# EAGLE design WaterFlowSensor-RJ11-Adaptor-V2.0 (EAGLE 7.4.0)
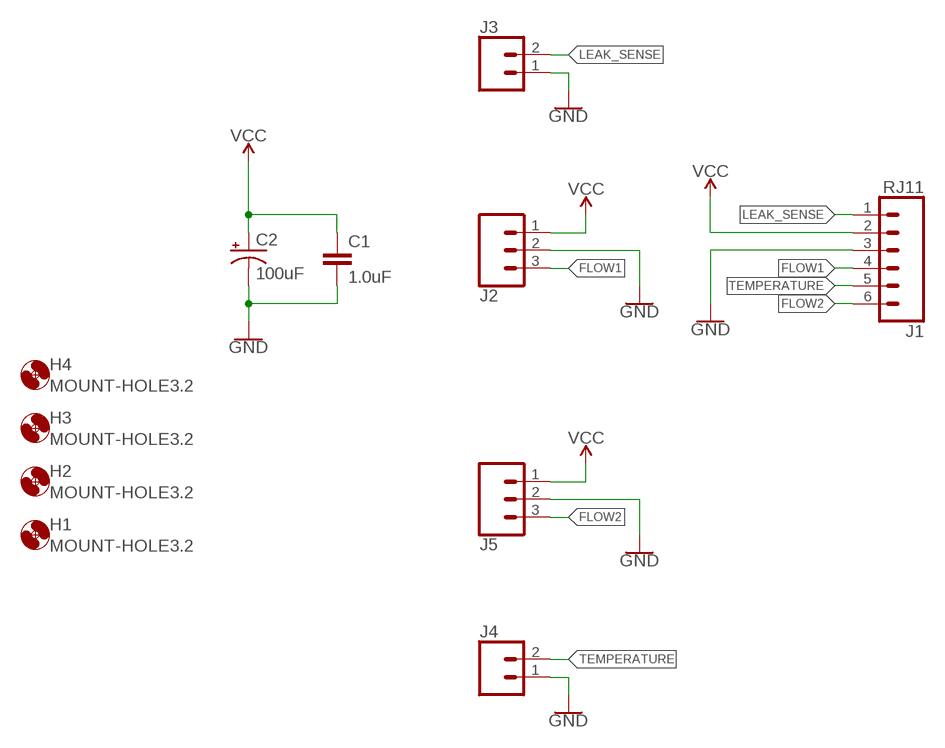
[diagram p0: schematic, sheet 1]

## Parts
C1  1.0uF  1.0UF-0805-25V-(+80/-20%)  [0805]
C2  100uF  100UF-POLAR-RADIAL-2.5MM-25V-20%  [CPOL-RADIAL-2.5MM-6.5MM]
H1  MOUNT-HOLE3.2  [3,2]
H2  MOUNT-HOLE3.2  [3,2]
H3  MOUNT-HOLE3.2  [3,2]
H4  MOUNT-HOLE3.2  [3,2]
J1  RJ11  RJ11-6  [RJ11-6]
J2  CONN_03JST-HX-PTH-VERT  [JST-HX-3-PTH-VERT]
J3  CONN_02  [1X02]
J4  CONN_02POLAR  [MOLEX-1X2]
J5  CONN_03JST-HX-PTH-VERT  [JST-HX-3-PTH-VERT]

## Nets
FLOW1: J1.4 J2.3
FLOW2: J1.6 J5.3
GND: C1.2 C2.2(-) J1.3 J2.2 J3.1 J4.1 J5.2
LEAK_SENSE: J1.1 J3.2
TEMPERATURE: J1.5 J4.2
VCC: C1.1 C2.1(+) J1.2 J2.1 J5.1

## Library data of the parts
C1 = SparkFun-Capacitors:1.0UF: 1µF ceramic capacitors A capacitor is a passive two-terminal electrical component used to store electrical energy temporarily in an electric field.; PROD_ID: CAP-11625
C2 = SparkFun-Capacitors:100UF-POLAR: 100µF polarized capacitors A capacitor is a passive two-terminal electrical component used to store electrical energy temporarily in an electric field.; PROD_ID: CAP-08439
H1-H4 = ThingySticks:MOUNT-HOLE: MOUNTING HOLE with drill center marker
J1 = SparkFun-Connectors:RJ11-6: RJ11 Jack - 6 pin Commonly found on CAT3 devices and some Microchip programmers. Here is the connector we sell at SparkFun: RJ11 6-Pin Connector <https://www.sparkfun.com/products/132> (PRT-00132) Datasheet <http://www.sparkfun.com/datasheets/Prototyping/Connectors/RJ11-Datasheet.pdf> It is used on this SparkFun product: SparkFun Weather Shield <https://www.sparkfun.com/products/12081> (DEV-12081) Weather Meters <https://www.sparkfun.com/products/8942> (SEN-08942); PROD_ID: CONN-08590; SF_ID: PRT-00132
J2 J5 = Tinamous:CONN_03: Multi connection point. Often used as Generic Header-pin footprint for 0.1 inch spaced/style header connections On any of the 0.1 inch spaced packages, you can populate with these: Break Away Headers - Straight <https://www.sparkfun.com/products/116> (PRT-00116) Break Away Male Headers - Right Angle <https://www.sparkfun.com/products/553> (PRT-00553) Female Headers <https://www.sparkfun.com/products/115> (PRT-00115) Break Away Headers - Machine Pin <https://www.sparkfun.com/products/117> (PRT-00117) Break Away Female Headers - Swiss Machine Pin <https://www.sparkfun.com/products/743> (PRT-00743) Stackable Header - 3 Pin (Female, 0.1") <https://www.sparkfun.com/products/13875> (PRT-13875) For SCREWTERMINALS and SPRING TERMINALS visit here: Screw Terimnals on SparkFun.com <https://www.sparkfun.com/search/results?term=Screw+Terminals> (5mm/3.5mm/2.54mm spacing) This device is also useful as a general connection point to wire up your design to another part of your project. Our various solder wires solder well into these plated through hole pads. Hook-Up Wire - Assortment (Stranded, 22 AWG) <https://www.sparkfun.com/products/11375> (PRT-11375) Hook-Up Wire - Assortment (Solid Core, 22 AWG) <https://www.sparkfun.com/products/11367> (PRT-11367) View the entire wire category on our website here <https://www.sparkfun.com/categories/141> Special notes: Molex polarized connector foot print use with SKU : PRT-08232 with associated crimp pins and housings.
J3 = SparkFun-Connectors:CONN_02: Multi connection point. Often used as Generic Header-pin footprint for 0.1 inch spaced/style header connections On any of the 0.1 inch spaced packages, you can populate with these: Break Away Headers - Straight <https://www.sparkfun.com/products/116> (PRT-00116) Break Away Male Headers - Right Angle <https://www.sparkfun.com/products/553> (PRT-00553) Female Headers <https://www.sparkfun.com/products/115> (PRT-00115) Break Away Headers - Machine Pin <https://www.sparkfun.com/products/117> (PRT-00117) Break Away Female Headers - Swiss Machine Pin <https://www.sparkfun.com/products/743> (PRT-00743) For SCREWTERMINALS and SPRING TERMINALS visit here: Screw Terimnals on SparkFun.com <https://www.sparkfun.com/search/results?term=Screw+Terminals> (5mm/3.5mm/2.54mm spacing) This device is also useful as a general connection point to wire up your design to another part of your project. Our various solder wires solder well into these plated through hole pads. Hook-Up Wire - Assortment (Stranded, 22 AWG) <https://www.sparkfun.com/products/11375> (PRT-11375) Hook-Up Wire - Assortment (Solid Core, 22 AWG) <https://www.sparkfun.com/products/11367> (PRT-11367) View the entire wire category on our website here <https://www.sparkfun.com/categories/141> Special notes: Molex polarized connector foot print use with: PRT-08233 with associated crimp pins and housings. 2.54_SCREWTERM for use with PRT-10571. 3.5mm Screw Terminal footprints for PRT-08084 5mm Screw Terminal footprints for use with PRT-08432
J4 = SparkFun-Connectors:CONN_02: Multi connection point. Often used as Generic Header-pin footprint for 0.1 inch spaced/style header connections On any of the 0.1 inch spaced packages, you can populate with these: Break Away Headers - Straight <https://www.sparkfun.com/products/116> (PRT-00116) Break Away Male Headers - Right Angle <https://www.sparkfun.com/products/553> (PRT-00553) Female Headers <https://www.sparkfun.com/products/115> (PRT-00115) Break Away Headers - Machine Pin <https://www.sparkfun.com/products/117> (PRT-00117) Break Away Female Headers - Swiss Machine Pin <https://www.sparkfun.com/products/743> (PRT-00743) For SCREWTERMINALS and SPRING TERMINALS visit here: Screw Terimnals on SparkFun.com <https://www.sparkfun.com/search/results?term=Screw+Terminals> (5mm/3.5mm/2.54mm spacing) This device is also useful as a general connection point to wire up your design to another part of your project. Our various solder wires solder well into these plated through hole pads. Hook-Up Wire - Assortment (Stranded, 22 AWG) <https://www.sparkfun.com/products/11375> (PRT-11375) Hook-Up Wire - Assortment (Solid Core, 22 AWG) <https://www.sparkfun.com/products/11367> (PRT-11367) View the entire wire category on our website here <https://www.sparkfun.com/categories/141> Special notes: Molex polarized connector foot print use with: PRT-08233 with associated crimp pins and housings. 2.54_SCREWTERM for use with PRT-10571. 3.5mm Screw Terminal footprints for PRT-08084 5mm Screw Terminal footprints for use with PRT-08432; SF_ID: PRT-09918

## Board
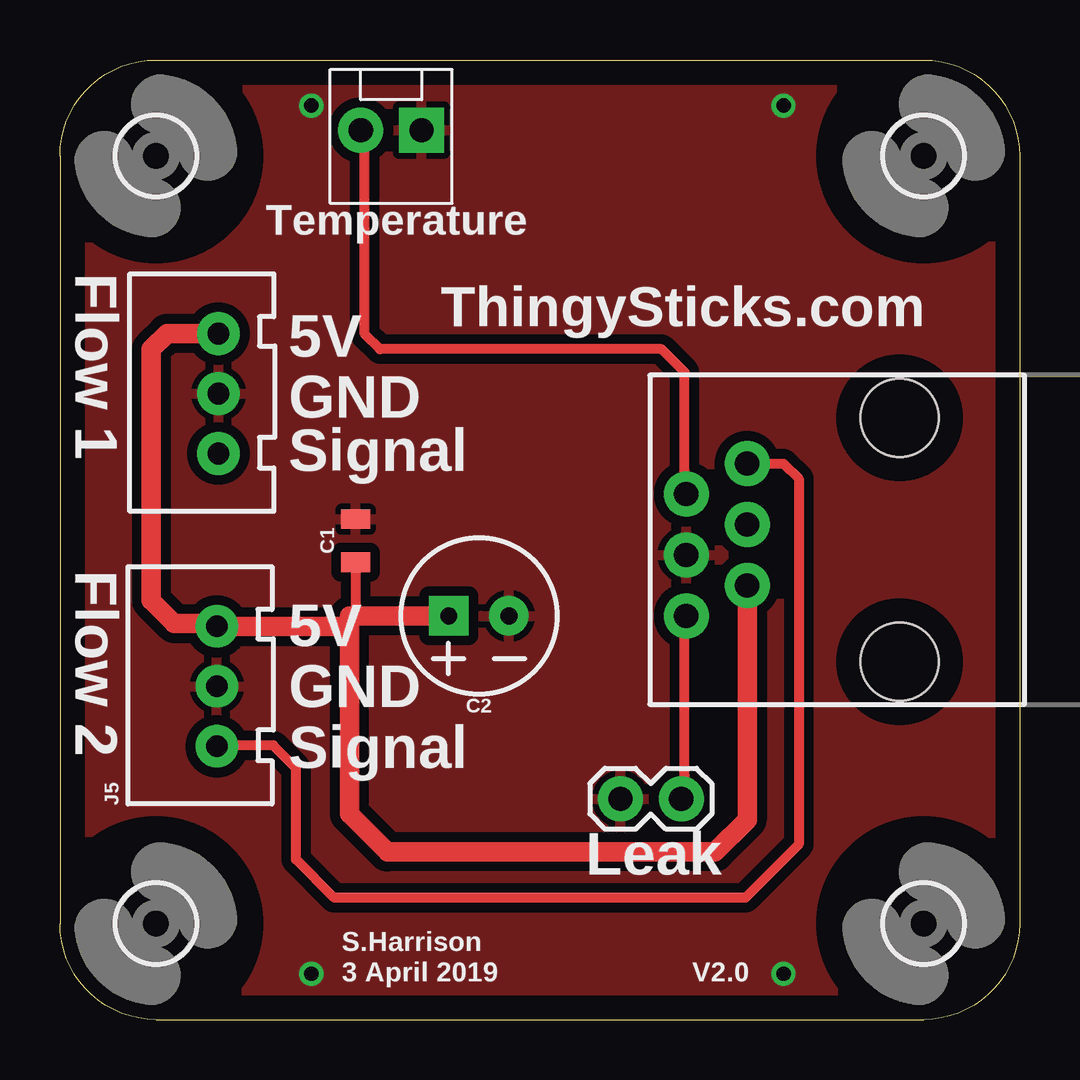
[diagram p1: board, top side]
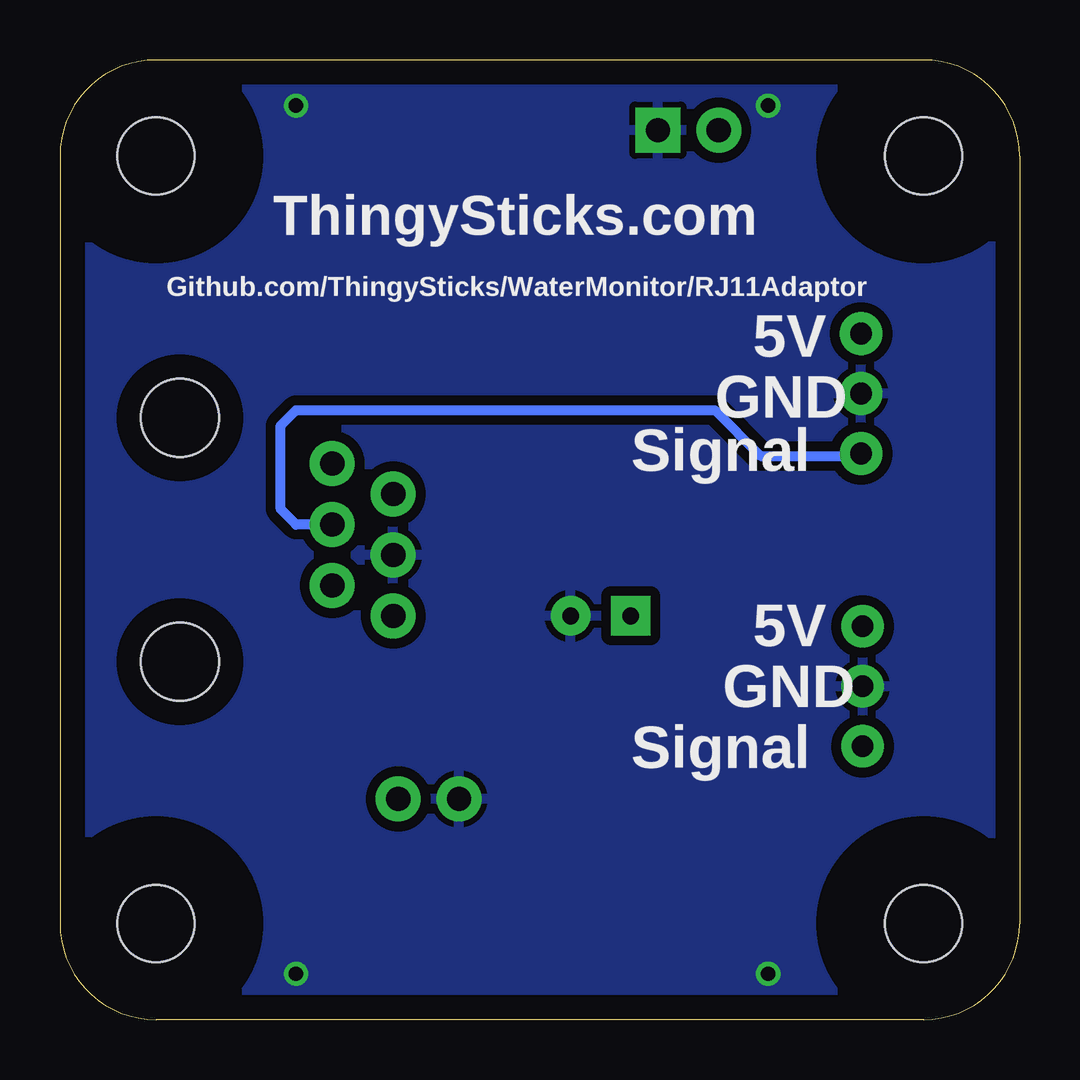
[diagram p2: board, bottom side, seen from below]

Size 40 x 40 mm. Coordinates in mm from the lower left corner, seen from the top.
Outline: 4,0 36,0 arc90 40,4 40,36 arc90 36,40 4,40 arc90 0,36 0,4 arc90 4,0
Copper layers (1*16): Top 0.035mm / dielectric 1.5mm / Bottom 0.035mm
Design rules "default": minimum track width 10mil, minimum drill 0.6mm, track to track 8mil, track to pad 8mil, pad to pad 8mil, via to via 8mil, smd to smd 8mil, copper to edge 40mil, drill to drill 8mil, minimum pad ring 10mil, minimum via ring 8mil, stop-mask expansion 4mil, vias tented up to drill 0mil, thermal gap 10mil

### Footprints (pad centres in the part's own frame; a part is rotated, then mirrored left to right if it is on the bottom)
0805 = smd 0.8 x 1.2: 1 -0.9,0; 2 0.9,0
CPOL-RADIAL-2.5MM-6.5MM = drill 0.7 pad 1.651 square: 1 1.25,0 | drill 0.7 pad 1.651: 2 -1.25,0
3,2 = hole 3.2: 0,0
RJ11-6 = drill 1.016 pad 1.88: 1 -3.175,8.89; 2 -1.905,6.35; 3 -0.635,8.89; 4 0.635,6.35; 5 1.905,8.89; 6 3.175,6.35 | hole 3.251: -5.08,0; 5.08,0
JST-HX-3-PTH-VERT = drill 0.9 pad 1.778: 1 7.5,2.35; 2 5,2.35; 3 2.5,2.35
1X02 = drill 1.016 pad 1.88: 1 0,0; 2 2.54,0
MOLEX-1X2 = drill 1.016 pad 1.88 square: 1 0,0 | drill 1.016 pad 1.88: 2 2.54,0

### Placement (x,y rotation side)
C1  12.32,19.96 90 top
C2  17.46,16.83 180 top
H1  4,4 0 top
H2  4,36 0 top
H3  36,36 0 top
H4  36,4 0 top
J1  35,20 90 top
J2  8.96,21.09 90 top
J3  23.36,9.2 0 top
J4  15.07,37.07 180 top
J5  8.89,8.89 90 top

### Tracks (layer width: path | path; a pad name or v marks a point on that pad's centre or on a via)
FLOW1
  Bottom 0.406: J1.4 30.16,20.64 30.8,21.27 30.8,24.77 30.16,25.4 12.7,25.4 10.79,23.5 6.71,23.5 J2.3
FLOW2
  Top 0.406: J1.6 30.16,23.18 30.8,22.54 30.8,7.3 28.57,5.08 11.43,5.08 9.84,6.67 9.84,10.48 8.89,11.43 6.58,11.43 J5.3
GND  (via drill 0.6)
  other vias: 10.48,38.1 30.16,38.1 30.16,1.91 10.48,1.91
  pour Bottom (isolate 0.406): 3.81,0 35.88,0 arc90 40.01,4.13 40.01,35.88 arc90 35.88,40.01 4.13,40.01 arc90 0,35.88 0,3.81 arc90
  pour Top (isolate 0.406): 4.13,0 35.88,0 arc90 40.01,4.13 40.01,35.88 arc90 35.88,40.01 4.13,40.01 arc90 0,35.88 0,4.13 arc90
LEAK_SENSE
  Top 0.406: J3.2 26.03,9.2 26.04,10.16 26.04,16.75 J1.1
TEMPERATURE
  Top 0.406: J1.5 26.04,21.91 26.04,22.86 26.04,26.99 25.08,27.94 13.34,27.94 12.7,28.57 12.7,36.83 12.38,37.15 J4.2
VCC
  Top 0.406: C1.1 12.32,16.89 12.06,16.83
  Top 0.813: J1.2 28.65,8.33 27.3,6.99 13.65,6.99 12.06,8.57 12.06,16.51 | 12.06,16.51 12.06,16.83 C2.1 | J2.1 4.46,28.59 3.81,27.94 3.81,17.46 4.76,16.51 6.42,16.51 J5.1 11.95,16.39 12.06,16.51

### Text on the board
tNames: Temperature | Flow 1 | ThingySticks.com | 5V | GND | Signal | Flow 2 | 5V | GND | Signal | Leak | S.Harrison | 3 April 2019 | V2.0
bNames: ThingySticks.com | Github.com/ThingySticks/WaterMonitor/RJ11Adaptor | 5V | GND | Signal | 5V | GND | Signal